# Altium schematic sheet Power_System.SchDoc
size A4; CompanyName: SPAN; Engineer: Goverdhan; Organization: University of Utah; Address1: 50 S Central Campus Dr; Address2: MEB Rm 3129; Address3: Salt Lake City, Utah 84115; Address4: USA; Revision: 1; SheetNumber: 2; SheetTotal: 4
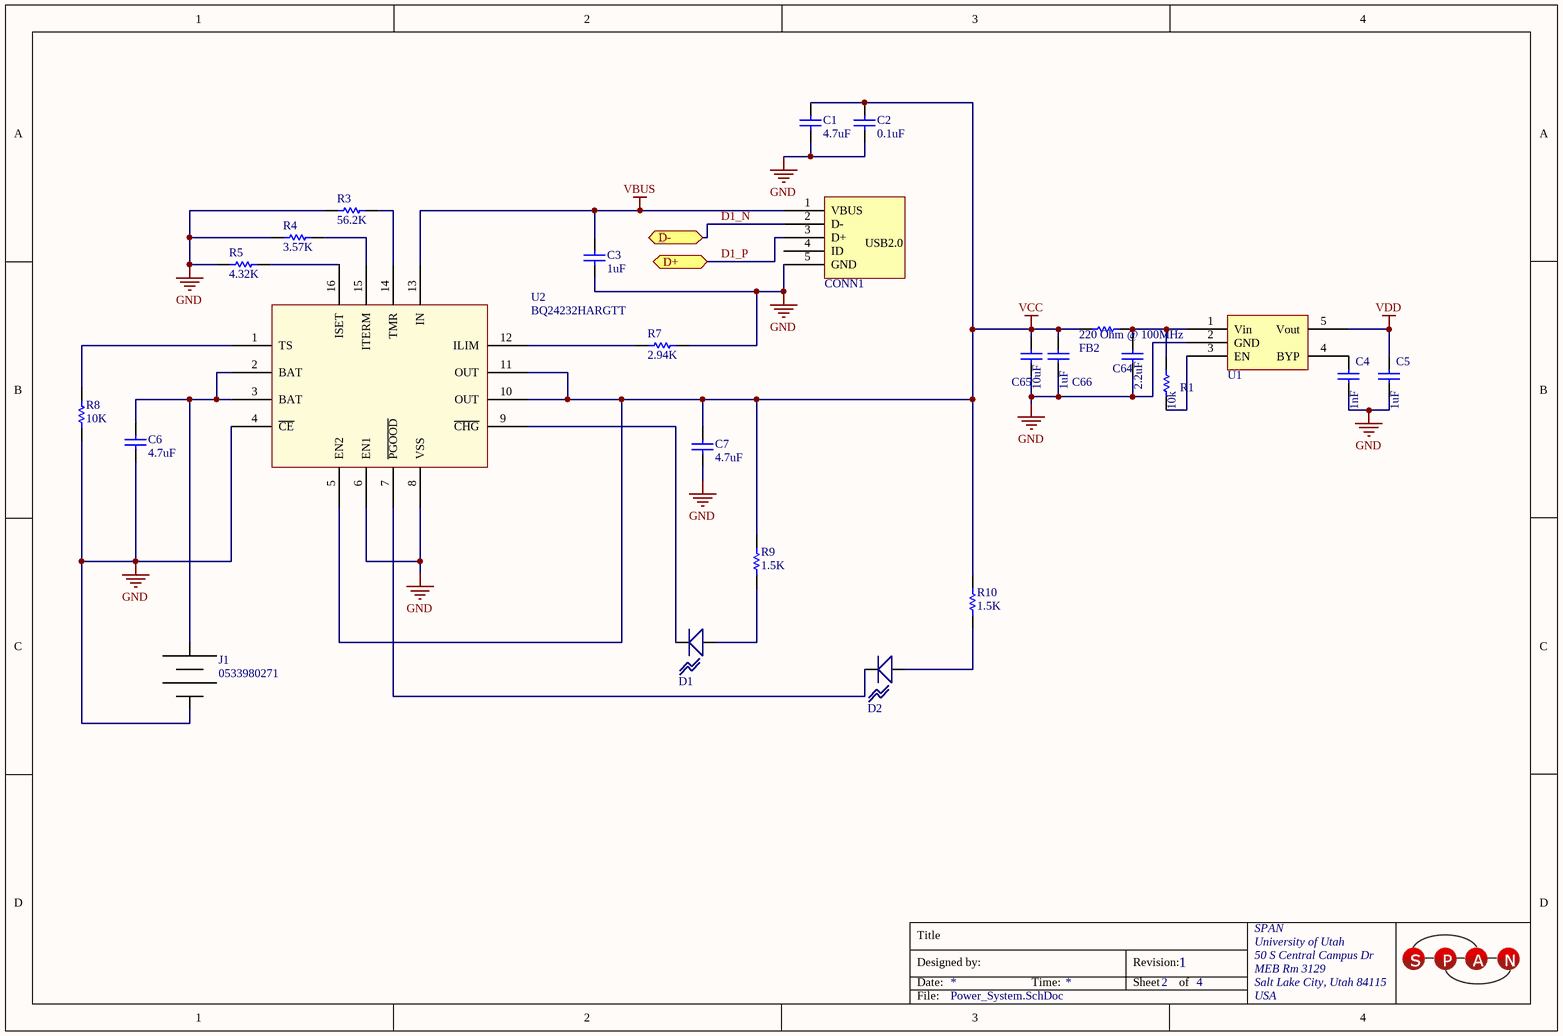
[diagram p0: Power_System.SchDoc]

## Parts
C1  4.7uF  [0603_Cap]
C2  0.1uF  [0603_Cap]
C3  1uF  [0603_Cap]
C4  10uF  [0603_Cap]  (value not drawn)
C5  GRM188R61A105KA61D  [CAPC1608X08N (0603)]  (value not drawn)
C6  4.7uF  [0603_Cap]
C7  4.7uF  [0603_Cap]
C64  GRM188F51A225ZE01D  [CAPC1608X08N (0603)]  (value not drawn)
C65  GRM188R60J106ME47D  [CAPC1608X08N (0603)]  (value not drawn)
C66  GRM188R61A105KA61D  [CAPC1608X08N (0603)]  (value not drawn)
CONN1  10118193-0001LF  [USB_micro_B]  (value not drawn)
D1  LTST-C191KFKT  [0603_LED]  (value not drawn)
D2  LTST-C191KFKT  [0603_LED]  (value not drawn)
FB2  BLM18BD221SN1D  [RESC1608X06N (0603)]  (value not drawn)
J1  0533980271  [53398-0271]
R1  10K  [0603_RES]  (value not drawn)
R3  56.2K  [0603_RES]
R4  3.57K  [0603_RES]
R5  4.32K  [0603_RES]
R7  2.94K  [0603_RES]
R8  10K  [0603_RES]
R9  1.5K  [0603_RES]
R10  1.5K  [0603_RES]
U1  TPS2147IDGQG4  [SOT95P280X145-5N]  (value not drawn)
U2  BQ24232HARGTT  [QFN_16_BQ24232]

## Ports
D+ (bidir), D- (bidir)

## Nets
GND: C1.1 C2.1 C3.1 C4.1 C5.1 C6.1 C7.1 C64.1 C65.1 C66.1 CONN1.5(GND) J1.2(Neg) R3.1 R4.1 R5.1 R7.2 R8.1 U1.2(GND) U2.4(~{CE}) U2.6(EN1) U2.8(VSS)
VBUS: C3.2 CONN1.1(VBUS) U2.13(IN)
VCC: C1.2 C2.2 C7.2 C65.2 C66.2 FB2.1 R9.2 R10.2 U2.5(EN2) U2.10(OUT) U2.11(OUT)
VDD: C5.2 U1.5(Vout)
D1_N: CONN1.2(D-) ; port D-
D1_P: CONN1.3(D+) ; port D+
NetC4_2: C4.2 U1.4(BYP)
NetC6_2: C6.2 J1.1(Pos) U2.2(BAT) U2.3(BAT)
NetC64_2: C64.2 FB2.2 R1.2 U1.1(Vin)
NetD1_1: D1.1 R9.1
NetD1_2: D1.2 U2.9(~{CHG})
NetD2_1: D2.1 R10.1
NetD2_2: D2.2 U2.7(~{PGOOD})
NetR1_1: R1.1 U1.3(EN)
NetR3_2: R3.2 U2.14(TMR)
NetR4_2: R4.2 U2.15(ITERM)
NetR5_2: R5.2 U2.16(ISET)
NetR7_1: R7.1 U2.12(ILIM)
NetR8_2: R8.2 U2.1(TS)

Not connected (* = marked no-connect by the designer): CONN1 4(ID)

## Notes on the sheet
- Title
- Designed by:
- Date:
- Time:
- Revision:
- Sheet
- of
- File:
- (in symbol 10118193-0001LF) USB2.0
- (in symbol GRM188F51A225ZE01D) 2.2uF
- (in symbol GRM188R60J106ME47D) 10uF
- (in symbol GRM188R61A105KA61D) 1uF
- (in symbol GRM1885C1H102JA01D) 1nF

## Library data of the parts
C1 C6 C7 = JMK107BJ475MAHT: Manufacturer: Taiyo Yuden; Capacitance: 4.7µF; Tolerance: ±20%; Voltage - Rated: 6.3V; Temperature Coefficient: X5R; Supplier 1: Digi-Key; Manufacturer Part Number: JMK107BJ475MAHT; RoHS: RoHS Compliant; Category: Capacitors; Stock 1: 4000; Pricing 1: 4000=0.03053, 8000=0.0284, 12000=0.02698, 28000=0.02556, 100000=0.01935 (USD); Packaging: Tape & Reel (TR); Part Status: Active; Operating Temperature: -55°C ~ 85°C; Features: -; Ratings: AEC-Q200; Applications: Automotive, SMPS Filtering; Failure Rate: -; Mounting Type: Surface Mount, MLCC; Package / Case: 0603 (1608 Metric); Size / Dimension: 0.063" L x 0.031" W (1.60mm x 0.80mm); Height - Seated (Max): -; Thickness (Max): 0.035" (0.90mm); Lead Spacing: -; Lead Style: -; ComponentLink1URL: http://www.yuden.co.jp/productdata/catalog/en/mlcc_all_hq_e.pdf; ComponentLink1Description: http://www.yuden.co.jp/productdata/catalog/en/mlcc_all_hq_e.pdf; Supplier Part Number 1: 587-4903-2-ND
C2 = 0603YC104KAT4A: CAP CER 0.1UF 16V X7R 0603; Manufacturer: AVX Corporation; Capacitance: 0.1µF; Tolerance: ±10%; Supplier 1: Digi-Key; Manufacturer Part Number: 0603YC104KAT4A; RoHS: RoHS Compliant; Category: Capacitors; Stock 1: 15000; Pricing 1: 15000=0.00344, 30000=0.00327, 75000=0.00292, 105000=0.00237 (USD); Packaging: Tape & Reel (TR); Part Status: Active; Voltage - Rated: 16V; Temperature Coefficient: X7R; Operating Temperature: -55°C ~ 125°C; Features: -; Ratings: -; Applications: General Purpose; Failure Rate: -; Mounting Type: Surface Mount, MLCC; Package / Case: 0603 (1608 Metric); Size / Dimension: 0.063" L x 0.032" W (1.60mm x 0.81mm); Height - Seated (Max): -; Thickness (Max): 0.035" (0.90mm); Lead Spacing: -; Lead Style: -; ComponentLink1URL: http://datasheets.avx.com/X7RDielectric.pdf; ComponentLink1Description: http://datasheets.avx.com/X7RDielectric.pdf; Supplier Part Number 1: 478-10054-2-ND
C3 = JMK107C6105KA-T: CAP CER 1uF SMD; Manufacturer: Taiyo Yuden; Capacitance: 1µF; Tolerance: ±10%; Voltage - Rated: 6.3V; Temperature Coefficient: X6S; Supplier 1: Digi-Key; Manufacturer Part Number: JMK107C6105KA-T; RoHS: RoHS Compliant; Category: Capacitors; Stock 1: 8000; Pricing 1: 4000=0.02281, 8000=0.02122, 12000=0.02016, 28000=0.0191, 100000=0.01446 (USD); Packaging: Tape & Reel (TR); Part Status: Active; Operating Temperature: -55°C ~ 105°C; Features: -; Ratings: -; Applications: SMPS Filtering; Failure Rate: -; Mounting Type: Surface Mount, MLCC; Package / Case: 0603 (1608 Metric); Size / Dimension: 0.063" L x 0.031" W (1.60mm x 0.80mm); Height - Seated (Max): -; Thickness (Max): 0.035" (0.90mm); Lead Spacing: -; Lead Style: -; ComponentLink1URL: http://www.yuden.co.jp/productdata/catalog/en/mlcc_all_e.pdf; ComponentLink1Description: http://www.yuden.co.jp/productdata/catalog/en/mlcc_all_e.pdf; Supplier Part Number 1: 587-4904-2-ND
C4 = GRM1885C1H102JA01D: CAP CER 1000PF 50V 5% NP0 0603; Manufacturer: Murata Electronics North America; Temperature Coefficient: C0G, NP0; Supplier 1: Digi-Key; Manufacturer Part Number: GRM1885C1H102JA01D; RoHS: RoHS Compliant; Category: Capacitors; Stock 1: 140000; Pricing 1: 4000=0.00863, 8000=0.00788, 12000=0.0075, 28000=0.00713, 100000=0.00516 (USD); Packaging: Tape & Reel (TR); Capacitance: 1000pF; Voltage - Rated: 50V; Tolerance: ±5%; Mounting Type: Surface Mount, MLCC; Operating Temperature: -55°C ~ 125°C; Applications: General Purpose; Ratings: -; Package / Case: 0603 (1608 Metric); Size / Dimension: 0.063" L x 0.031" W (1.60mm x 0.80mm); Height - Seated (Max): -; Thickness (Max): 0.035" (0.90mm); Lead Spacing: -; Features: -; Lead Style: -; ComponentLink1URL: http://www.murata.com/products/catalog/pdf/c02e.pdf; ComponentLink1Description: http://www.murata.com/products/catalog/pdf/c02e.pdf
C5 C66 = GRM188R61A105KA61D: CAP CER 1UF 10V 10% X5R 0603; Manufacturer: Murata Electronics North America; Capacitance: 1.0µF; Supplier 1: Digi-Key; Manufacturer Part Number: GRM188R61A105KA61D; RoHS: RoHS Compliant; Category: Capacitors; Stock 1: 244919; Pricing 1: 1=0.1, 10=0.041, 50=0.0224, 100=0.019, 250=0.01552, 500=0.01328, 1000=0.01035 (USD); Packaging: Cut Tape (CT); Voltage - Rated: 10V; Tolerance: ±10%; Temperature Coefficient: X5R; Mounting Type: Surface Mount, MLCC; Operating Temperature: -55°C ~ 85°C; Applications: General Purpose; Ratings: -; Package / Case: 0603 (1608 Metric); Size / Dimension: 0.063" L x 0.031" W (1.60mm x 0.80mm); Height - Seated (Max): -; Thickness (Max): 0.035" (0.90mm); Lead Spacing: -; Features: -; Lead Style: -; ComponentLink1URL: http://search.murata.co.jp/Ceramy/image/img/A01X/G101/ENG/GRM188R61A105KA61-01.pdf; ComponentLink1Description: http://search.murata.co.jp/Ceramy/image/img/A01X/G101/ENG/GRM188R61A105KA61-01.pdf
C64 = GRM188F51A225ZE01D: CAP CER 2.2UF 10V Y5V 0603; Manufacturer: Murata Electronics North America; Capacitance: 2.2µF; Tolerance: -20%, +80%; Temperature Coefficient: Y5V (F); Supplier 1: Digi-Key; Manufacturer Part Number: GRM188F51A225ZE01D; RoHS: RoHS Compliant; Category: Capacitors; Stock 1: 8000; Pricing 1: 4000=0.02043, 8000=0.019, 12000=0.01805, 28000=0.0171 (USD); Packaging: Tape & Reel (TR); Voltage - Rated: 10V; Mounting Type: Surface Mount, MLCC; Operating Temperature: -30°C ~ 85°C; Applications: General Purpose; Ratings: -; Package / Case: 0603 (1608 Metric); Size / Dimension: 0.063" L x 0.031" W (1.60mm x 0.80mm); Height - Seated (Max): -; Thickness (Max): 0.035" (0.90mm); Lead Spacing: -; Features: -; Lead Style: -; ComponentLink1URL: http://search.murata.co.jp/Ceramy/image/img/A01X/G101/ENG/GRM188F51A225ZE01-01.pdf; ComponentLink1Description: http://search.murata.co.jp/Ceramy/image/img/A01X/G101/ENG/GRM188F51A225ZE01-01.pdf
C65 = GRM188R60J106ME47D: CAP CER 10UF 6.3V 20% X5R 0603; Manufacturer: Murata Electronics North America; Capacitance: 10µF; Supplier 1: Digi-Key; Manufacturer Part Number: GRM188R60J106ME47D; RoHS: RoHS Compliant; Category: Capacitors; Stock 1: 2128324; Pricing 1: 1=0.24, 10=0.2, 50=0.1126, 100=0.1, 250=0.075, 500=0.06626, 1000=0.05875 (USD); Packaging: Digi-Reel®; Voltage - Rated: 6.3V; Tolerance: ±20%; Temperature Coefficient: X5R; Mounting Type: Surface Mount, MLCC; Operating Temperature: -55°C ~ 85°C; Applications: General Purpose; Ratings: -; Package / Case: 0603 (1608 Metric); Size / Dimension: 0.063" L x 0.031" W (1.60mm x 0.80mm); Height - Seated (Max): -; Thickness (Max): 0.035" (0.90mm); Lead Spacing: -; Features: -; Lead Style: -; ComponentLink1URL: http://search.murata.co.jp/Ceramy/image/img/A01X/G101/ENG/GRM188R60J106ME47-01.pdf; ComponentLink1Description: http://search.murata.co.jp/Ceramy/image/img/A01X/G101/ENG/GRM188R60J106ME47-01.pdf; Supplier 2: Digi-Key
CONN1 = 10118193-0001LF: CONN USB MICRO B RECPT SMT R/A; Manufacturer: Amphenol FCI; Connector Type: USB - micro B; Number of Contacts: 5; Gender: Receptacle; Specifications: USB 2.0; Number of Ports: 1; Current Rating: 1.8A per Contact; Voltage - Rated: 100VAC; Mating Cycles: 10000; Shielding: Shielded; Material Flammability Rating: UL94 V-0; Supplier 1: Digi-Key; Manufacturer Part Number: 10118193-0001LF; RoHS: RoHS Compliant; Category: Connectors, Interconnects; Stock 1: 88800; Pricing 1: 1200=0.19845, 2400=0.18144, 6000=0.1701, 8400=0.15876, 12000=0.15309, 30000=0.15082, 60000=0.14742 (USD); Packaging: Tape & Reel (TR); Part Status: Active; Mounting Type: Surface Mount, Right Angle; Through Hole; Mounting Feature: Horizontal; Termination: Solder; Features: Solder Retention; Ingress Protection: -; Operating Temperature: -30°C ~ 80°C; Contact Finish: Gold; Shell/Shielding Material: Steel, Stainless; Insulation Color: Black; ComponentLink1URL: http://portal.fciconnect.com/Comergent//fci/drawing/10118193.pdf; ComponentLink1Description: http://portal.fciconnect.com/Comergent//fci/drawing/10118193.pdf; Supplier Part Number 1: 609-4616-2-ND
D1 D2 = LTST-C191KFKT: LED ORANGE CLEAR 0603 SMD; Manufacturer: Lite-On Inc.; Lens Color: Colorless; Millicandela Rating: 90mcd; Lens Style/Size: Rectangle with Flat Top, 1.10mm x 0.80mm; Voltage - Forward (Vf) (Typ): 2V; Current - Test: 20mA; Viewing Angle: 130°; Wavelength - Dominant: 605nm; Wavelength - Peak: 611nm; Supplier 1: Digi-Key; Manufacturer Part Number: LTST-C191KFKT; RoHS: RoHS Compliant; Category: Optoelectronics; Stock 1: 160000; Pricing 1: 5000=0.0376, 10000=0.03384, 25000=0.03008, 50000=0.02726, 125000=0.02538 (USD); Packaging: Tape & Reel (TR); Part Status: Active; Color: Orange; Lens Transparency: Clear; Mounting Type: Surface Mount; Features: -; Package / Case: 0603 (1608 Metric); Size / Dimension: 1.60mm L x 0.80mm W; Height (Max): 0.55mm; ComponentLink1URL: http://optoelectronics.liteon.com/upload/download/DS22-2000-222/S_110_LTST-C191KFKT.pdf; ComponentLink1Description: http://optoelectronics.liteon.com/upload/download/DS22-2000-222/S_110_LTST-C191KFKT.pdf; Supplier Part Number 1: 160-1445-2-ND
FB2 = BLM18BD221SN1D: FERRITE CHIP 220 OHM 200MA 0603; Manufacturer: Murata Electronics North America; Impedance @ Frequency: 220 Ohm @ 100MHz; DC Resistance (DCR): 450 mOhm Max; Filter Type: Differential Mode - Single; Supplier 1: Digi-Key; Manufacturer Part Number: BLM18BD221SN1D; RoHS: RoHS Compliant; Category: Filters; Stock 1: 35645; Pricing 1: 1=0.1, 10=0.087, 50=0.0712, 100=0.0523, 250=0.038, 500=0.03484, 1000=0.0301 (USD); Packaging: Cut Tape (CT); Current Rating: 200mA; Package / Case: 0603 (1608 Metric); Mounting Type: Surface Mount; Height (Max): 0.037" (0.95mm); Size / Dimension: 0.063" L x 0.031" W (1.60mm x 0.80mm); ComponentLink1URL: http://search.murata.co.jp/Ceramy/image/img/PDF/ENG/L0110S0100BLM18B.pdf; ComponentLink1Description: http://search.murata.co.jp/Ceramy/image/img/PDF/ENG/L0110S0100BLM18B.pdf
J1 = 0533980271: CONN HEADER 2POS 1.25MM VERT SMD; Manufacturer: Molex Inc; Connector Type: Header, Male Blades; Number of Positions: 2; Pitch: 0.049" (1.25mm); Supplier 1: Digi-Key; RoHS: RoHS Compliant; Category: Connectors, Interconnects; Stock 1: 14126; Pricing 1: 1=1.4, 10=1.091, 25=1.0168, 50=0.923, 100=0.8323, 250=0.7014, 500=0.66448 (USD); Connector Style: -; Mounting Type: Surface Mount; Termination: Solder; Wire Gauge: -; Features: -; Color: Natural; Packaging: Cut Tape (CT); ComponentLink1URL: http://www.molex.com/pdm_docs/sd/533980271_sd.pdf; ComponentLink1Description: http://www.molex.com/pdm_docs/sd/533980271_sd.pdf; Supplier Part Number 1: WM7606CT-ND; Manufacturer Part Number: 0533980271
R1 = RC0603FR-0710KL: RES 10.0K OHM 1/10W 1% 0603 SMD; Manufacturer: Yageo; Power (Watts): 0.1W, 1/10W; Temperature Coefficient: ±100ppm/°C; Supplier 1: Digi-Key; Manufacturer Part Number: RC0603FR-0710KL; RoHS: RoHS Compliant; Category: Resistors; Stock 1: 11245000; Pricing 1: 5000=0.00171, 10000=0.00149, 25000=0.00131, 50000=0.0012, 125000=0.00117 (USD); Packaging: Tape & Reel (TR); Resistance (Ohms): 10k; Tolerance: ±1%; Composition: Thick Film; Features: -; Package / Case: 0603 (1608 Metric); Supplier Device Package: 0603; Size / Dimension: 0.063" L x 0.031" W (1.60mm x 0.80mm); Height: 0.022" (0.55mm); Number of Terminations: 2; ComponentLink1URL: http://www.yageo.com/documents/recent/PYu-RC0603_51_RoHS_L_4.pdf; ComponentLink1Description: http://www.yageo.com/documents/recent/PYu-RC0603_51_RoHS_L_4.pdf
R3 = ERA-3AEB5622V: RES SMD 56.2KOHM 0.1% 1/10W 0603; Manufacturer: Panasonic Electronic Components; Power (Watts): 0.1W, 1/10W; Temperature Coefficient: ±25ppm/°C; Supplier 1: Digi-Key; Manufacturer Part Number: ERA-3AEB5622V; RoHS: RoHS Compliant; Category: Resistors; Stock 1: 5000; Pricing 1: 5000=0.0354, 10000=0.03304, 25000=0.03139, 50000=0.03075, 125000=0.03009 (USD); Packaging: Tape & Reel (TR); Part Status: Active; Resistance (Ohms): 56.2k; Tolerance: ±0.1%; Composition: Thin Film; Features: Automotive AEC-Q200; Operating Temperature: -55°C ~ 155°C; Package / Case: 0603 (1608 Metric); Supplier Device Package: 0603; Size / Dimension: 0.063" L x 0.031" W (1.60mm x 0.80mm); Height - Seated (Max): 0.022" (0.55mm); Number of Terminations: 2; Failure Rate: -; ComponentLink1URL: https://industrial.panasonic.com/cdbs/www-data/pdf/RDA0000/AOA0000C237.pdf; ComponentLink1Description: https://industrial.panasonic.com/cdbs/www-data/pdf/RDA0000/AOA0000C237.pdf; Supplier Part Number 1: P56.2KDBTR-ND
R4 = TNPW06033K57BEEA: RES SMD 3.57KOHM 0.1% 1/10W 0603; Manufacturer: Vishay Dale; Power (Watts): 0.1W, 1/10W; Temperature Coefficient: ±25ppm/°C; Supplier 1: Digi-Key; Manufacturer Part Number: TNPW06033K57BEEA; RoHS: RoHS Compliant; Category: Resistors; Stock 1: 0; Pricing 1: 5000=0.1064 (USD); Packaging: Tape & Reel (TR); Part Status: Active; Resistance (Ohms): 3.57k; Tolerance: ±0.1%; Composition: Thin Film; Features: Anti-Sulfur, Automotive AEC-Q200, Moisture Resistant; Operating Temperature: -55°C ~ 125°C; Package / Case: 0603 (1608 Metric); Supplier Device Package: 0603; Size / Dimension: 0.063" L x 0.033" W (1.60mm x 0.85mm); Height - Seated (Max): 0.022" (0.55mm); Number of Terminations: 2; Failure Rate: -; ComponentLink1URL: http://www.vishay.com/docs/28758/tnpw_e3.pdf; ComponentLink1Description: http://www.vishay.com/docs/28758/tnpw_e3.pdf; Supplier Part Number 1: TNPW06033K57BEEA-ND
R5 = ERA-3AEB4321V: RES SMD 4.32KOHM 0.1% 1/10W 0603; Manufacturer: Panasonic Electronic Components; Power (Watts): 0.1W, 1/10W; Temperature Coefficient: ±25ppm/°C; Supplier 1: Digi-Key; Manufacturer Part Number: ERA-3AEB4321V; RoHS: RoHS Compliant; Category: Resistors; Stock 1: 5000; Pricing 1: 5000=0.0354, 10000=0.03304, 25000=0.03139, 50000=0.03075, 125000=0.03009 (USD); Packaging: Tape & Reel (TR); Part Status: Active; Resistance (Ohms): 4.32k; Tolerance: ±0.1%; Composition: Thin Film; Features: Automotive AEC-Q200; Operating Temperature: -55°C ~ 155°C; Package / Case: 0603 (1608 Metric); Supplier Device Package: 0603; Size / Dimension: 0.063" L x 0.031" W (1.60mm x 0.80mm); Height - Seated (Max): 0.022" (0.55mm); Number of Terminations: 2; Failure Rate: -; ComponentLink1URL: https://industrial.panasonic.com/cdbs/www-data/pdf/RDA0000/AOA0000C237.pdf; ComponentLink1Description: https://industrial.panasonic.com/cdbs/www-data/pdf/RDA0000/AOA0000C237.pdf; Supplier Part Number 1: P4.32KDBTR-ND
R7 = ERA-3AEB2941V: RES SMD 2.94KOHM 0.1% 1/10W 0603; Manufacturer: Panasonic Electronic Components; Power (Watts): 0.1W, 1/10W; Temperature Coefficient: ±25ppm/°C; Supplier 1: Digi-Key; Manufacturer Part Number: ERA-3AEB2941V; RoHS: RoHS Compliant; Category: Resistors; Stock 1: 10000; Pricing 1: 5000=0.0354, 10000=0.03304, 25000=0.03139, 50000=0.03075, 125000=0.03009 (USD); Packaging: Tape & Reel (TR); Part Status: Active; Resistance (Ohms): 2.94k; Tolerance: ±0.1%; Composition: Thin Film; Features: Automotive AEC-Q200; Operating Temperature: -55°C ~ 155°C; Package / Case: 0603 (1608 Metric); Supplier Device Package: 0603; Size / Dimension: 0.063" L x 0.031" W (1.60mm x 0.80mm); Height - Seated (Max): 0.022" (0.55mm); Number of Terminations: 2; Failure Rate: -; ComponentLink1URL: https://industrial.panasonic.com/cdbs/www-data/pdf/RDA0000/AOA0000C237.pdf; ComponentLink1Description: https://industrial.panasonic.com/cdbs/www-data/pdf/RDA0000/AOA0000C237.pdf; Supplier Part Number 1: P2.94KDBTR-ND
R8 = PHT0603Y1002BGT200: RES SMD 10KOHM 0.1% 0.0375W 0603; Manufacturer: Vishay Sfernice; Temperature Coefficient: ±15ppm/°C; Supplier 1: Digi-Key; Manufacturer Part Number: PHT0603Y1002BGT200; RoHS: RoHS Compliant; Category: Resistors; Stock 1: 400; Pricing 1: 200=6.6496, 400=6.0262, 600=5.6106, 1000=5.195 (USD); Packaging: Tape & Reel (TR); Part Status: Active; Resistance (Ohms): 10k; Tolerance: ±0.1%; Power (Watts): 0.0375W; Composition: Thin Film; Features: Anti-Sulfur; Operating Temperature: -55°C ~ 215°C; Package / Case: 0603 (1608 Metric); Supplier Device Package: 0603; Size / Dimension: 0.060" L x 0.033" W (1.52mm x 0.85mm); Height - Seated (Max): 0.025" (0.64mm); Number of Terminations: 2; Failure Rate: -; ComponentLink1URL: http://www.vishay.com/docs/53050/pht.pdf; ComponentLink1Description: http://www.vishay.com/docs/53050/pht.pdf; Supplier Part Number 1: PHTB-10KTR-ND
R9 R10 = CRCW06031K50JNEA: RES SMD 1.5K OHM 5% 1/10W 0603; Manufacturer: Vishay Dale; Power (Watts): 0.1W, 1/10W; Temperature Coefficient: ±200ppm/°C; Supplier 1: Digi-Key; Manufacturer Part Number: CRCW06031K50JNEA; RoHS: RoHS Compliant; Category: Resistors; Stock 1: 30000; Pricing 1: 5000=0.00266, 10000=0.00231, 25000=0.00203, 50000=0.0019 (USD); Packaging: Tape & Reel (TR); Part Status: Active; Resistance (Ohms): 1.5k; Tolerance: ±5%; Composition: Thick Film; Features: Automotive AEC-Q200; Operating Temperature: -55°C ~ 155°C; Package / Case: 0603 (1608 Metric); Supplier Device Package: 0603; Size / Dimension: 0.063" L x 0.033" W (1.60mm x 0.85mm); Height - Seated (Max): 0.020" (0.50mm); Number of Terminations: 2; Failure Rate: -; ComponentLink1URL: http://www.vishay.com/docs/20035/dcrcwe3.pdf; ComponentLink1Description: http://www.vishay.com/docs/20035/dcrcwe3.pdf; Supplier Part Number 1: 541-1.5KGTR-ND
U1 = FAN2500S30X: IC REG LDO 3V 0.1A SOT23-5; Manufacturer: Fairchild Semiconductor; Regulator Topology: Positive Fixed; Current - Output: 100mA; Voltage - Dropout (Typical): 0.1V @ 100mA; Number of Regulators: 1; Voltage - Input: Up to 6.5V; Supplier 1: Digi-Key; Manufacturer Part Number: FAN2500S30X; RoHS: RoHS Compliant; Category: Integrated Circuits (ICs); Stock 1: 6000; Pricing 1: 3000=0.25462, 6000=0.23706, 15000=0.22828, 30000=0.2195, 75000=0.21599, 150000=0.21072 (USD); Packaging: Tape & Reel (TR); Voltage - Output: 3V; Current - Limit (Min): -; Operating Temperature: -40°C ~ 125°C; Mounting Type: Surface Mount; Package / Case: SC-74A, SOT-753; Supplier Device Package: SOT-23-5; ComponentLink1URL: http://www.fairchildsemi.com/ds/FA/FAN2500.pdf; ComponentLink1Description: http://www.fairchildsemi.com/ds/FA/FAN2500.pdf
U2 = BQ24232HARGTT: IC LI-ION CHARGE PWR MGMT 16VQFN; Manufacturer: Texas Instruments; Battery Chemistry: Lithium-Ion; Number of Cells: 1; Current - Charging: Constant - Programmable; Programmable Features: Current, Timer; Fault Protection: Over Temperature, Over Voltage, Reverse Current, Short Circuit; Charge Current - Max: 500mA; Battery Pack Voltage: 4.2V; Voltage - Supply (Max): 10.2V; Interface: USB; Supplier 1: Digi-Key; RoHS: RoHS Compliant; Category: Integrated Circuits (ICs); Stock 1: 0; Pricing 1: 250=2.09792, 500=1.88244, 1250=1.5876 (USD); Packaging: Tape & Reel (TR); Part Status: Active; Operating Temperature: -5°C ~ 125°C (TJ); Package / Case: 16-VFQFN Exposed Pad; Supplier Device Package: 16-QFN (3x3); ComponentLink1URL: http://www.ti.com/lit/ds/symlink/bq24232ha.pdf; ComponentLink1Description: http://www.ti.com/lit/ds/symlink/bq24232ha.pdf; Supplier Part Number 1: 296-44194-2-ND; Manufacturer Part Number: BQ24232HARGTT